# Altium schematic sheet Boost_Bar_Termination_Resistors.SchDoc
size A
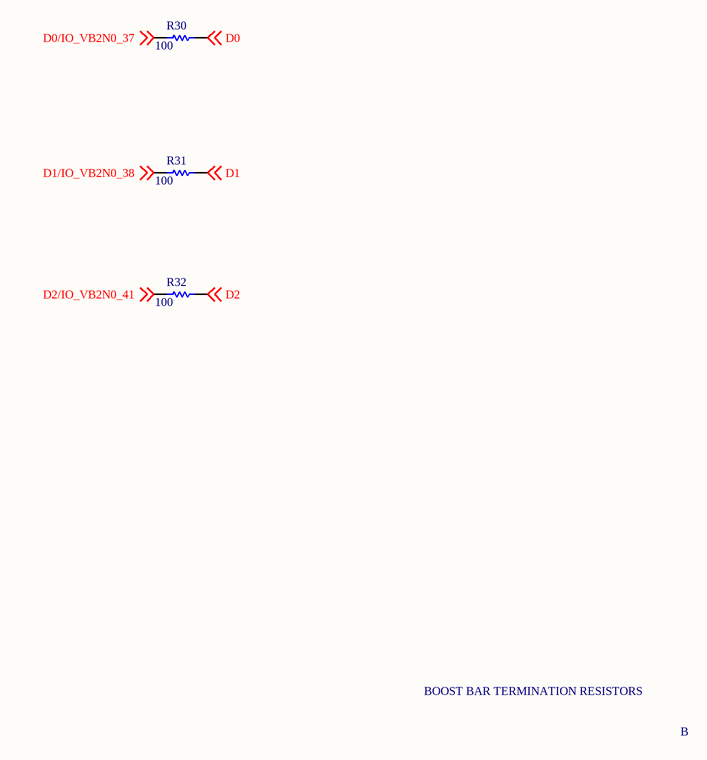
[diagram p0: Boost_Bar_Termination_Resistors.SchDoc]

## Parts
R30  value 100  [RES_0603]  (hidden comment: Figure out ohmage after RevA)
R31  value 100  [RES_0603]  (hidden comment: Figure out ohmage after RevA)
R32  value 100  [RES_0603]  (hidden comment: Figure out ohmage after RevA)

## Nets
D0: R30.2 ; off-sheet D0
D0/IO_VB2N0_37: R30.1 ; off-sheet D0/IO_VB2N0_37
D1: R31.2 ; off-sheet D1
D1/IO_VB2N0_38: R31.1 ; off-sheet D1/IO_VB2N0_38
D2: R32.2 ; off-sheet D2
D2/IO_VB2N0_41: R32.1 ; off-sheet D2/IO_VB2N0_41

## Notes on the sheet
- BOOST BAR TERMINATION RESISTORS
- B

## Library data of the parts
R30-R32 = Res1: Resistor; Published: 8-Jun-2000; LatestRevisionDate: 17-Jul-2002; LatestRevisionNote: Re-released for DXP Platform.; PackageReference: AXIAL-0.3; Publisher: Altium Limited; PackageDescription: Axial Device, Thru-Hole; 2 Leads; 0.3 in Pin Spacing